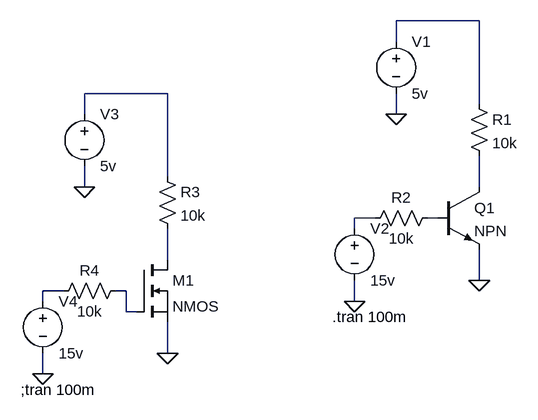
[diagram p0: schematic TR_Debugging.asc]
TR_Debugging.asc, the LTspice schematic file:
Version 4
SHEET 1 880 680
WIRE 208 -160 80 -160
WIRE 80 -128 80 -160
WIRE -272 -48 -400 -48
WIRE 208 -32 208 -160
WIRE -400 -16 -400 -48
WIRE 80 -16 80 -48
WIRE -272 80 -272 -48
WIRE -400 96 -400 64
WIRE 208 96 208 48
WIRE 48 144 16 144
WIRE 144 144 128 144
WIRE 16 160 16 144
WIRE -272 208 -272 160
WIRE 208 240 208 192
WIRE -432 256 -464 256
WIRE -336 256 -352 256
WIRE -464 272 -464 256
WIRE 16 272 16 240
WIRE -336 288 -336 256
WIRE -320 288 -336 288
WIRE -272 352 -272 304
WIRE -464 384 -464 352
FLAG 80 -16 0
FLAG 16 272 0
FLAG 208 240 0
FLAG -400 96 0
FLAG -464 384 0
FLAG -272 352 0
SYMBOL npn 144 96 R0
SYMATTR InstName Q1
SYMBOL res 192 -48 R0
SYMATTR InstName R1
SYMATTR Value 10k
SYMBOL voltage 80 -144 R0
SYMATTR InstName V1
SYMATTR Value 5v
SYMBOL voltage 16 144 R0
WINDOW 123 0 0 Left 0
WINDOW 39 0 0 Left 0
SYMATTR InstName V2
SYMATTR Value 15v
SYMBOL res 144 128 R90
WINDOW 0 0 56 VBottom 2
WINDOW 3 32 56 VTop 2
SYMATTR InstName R2
SYMATTR Value 10k
SYMBOL nmos -320 208 R0
SYMATTR InstName M1
SYMBOL res -288 64 R0
SYMATTR InstName R3
SYMATTR Value 10k
SYMBOL voltage -400 -32 R0
SYMATTR InstName V3
SYMATTR Value 5v
SYMBOL voltage -464 256 R0
WINDOW 123 0 0 Left 0
WINDOW 39 0 0 Left 0
SYMATTR InstName V4
SYMATTR Value 15v
SYMBOL res -336 240 R90
WINDOW 0 0 56 VBottom 2
WINDOW 3 32 56 VTop 2
SYMATTR InstName R4
SYMATTR Value 10k
TEXT -18 296 Left 2 !.tran 100m
TEXT -498 408 Left 2 !;tran 100m

The netlist it stands for:
* TR_Debugging.asc
Q1 N003 N005 0 0 NPN
R1 N001 N003 10k
V1 N001 0 5v
V2 N004 0 15v
R2 N005 N004 10k
M1 N006 N008 0 0 NMOS
R3 N002 N006 10k
V3 N002 0 5v
V4 N007 0 15v
R4 N008 N007 10k
.model NPN NPN
.model PNP PNP
.lib standard.bjt
.model NMOS NMOS
.model PMOS PMOS
.lib standard.mos
.tran 100m
;tran 100m
.backanno
.end